# Altium schematic sheet Servo1.SchDoc
size 420 x 297 mm; SheetNumber: 9; SheetTotal: 32
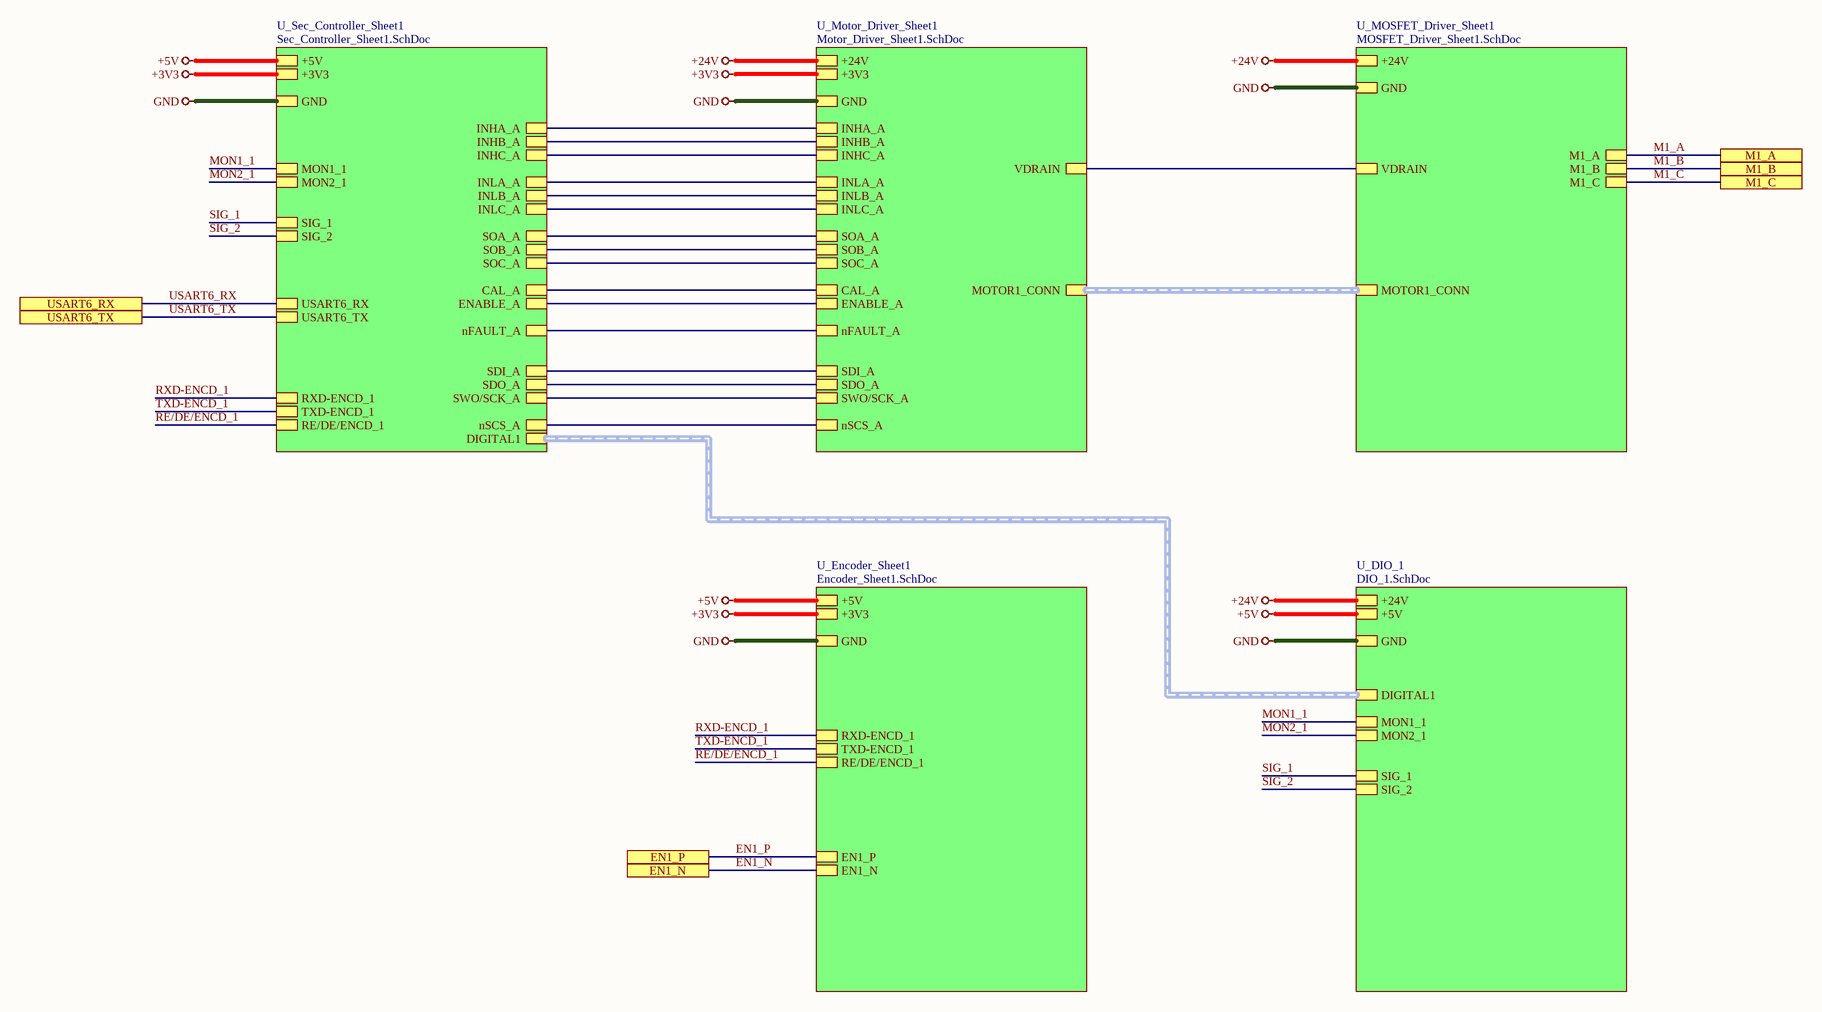
[diagram p0: Servo1.SchDoc]

## Sub-sheets
U_DIO_1 = DIO_1.SchDoc: +24V, +5V, GND, MON1_1, MON2_1, SIG_1, SIG_2, DIGITAL1 (harness DIGITAL1)
U_Encoder_Sheet1 = Encoder_Sheet1.SchDoc: +3V3, +5V, GND, RXD-ENCD_1, TXD-ENCD_1, RE/DE/ENCD_1, EN1_N, EN1_P
U_MOSFET_Driver_Sheet1 = MOSFET_Driver_Sheet1.SchDoc: +24V, GND, M1_A, M1_B, M1_C, MOTOR1_CONN (harness MOTOR1_CONN), VDRAIN
U_Motor_Driver_Sheet1 = Motor_Driver_Sheet1.SchDoc: +24V, +3V3, GND, MOTOR1_CONN (harness MOTOR1_CONN), INHA_A, INHB_A, INHC_A, INLA_A, INLB_A, INLC_A, nSCS_A, SDI_A, SDO_A, SWO/SCK_A, SOC_A, SOB_A, SOA_A, CAL_A, ENABLE_A, VDRAIN, nFAULT_A
U_Sec_Controller_Sheet1 = Sec_Controller_Sheet1.SchDoc: +3V3, GND, INHA_A, INHB_A, INHC_A, INLA_A, INLB_A, INLC_A, nSCS_A, SDI_A, SDO_A, SWO/SCK_A, SOC_A, SOB_A, SOA_A, CAL_A, ENABLE_A, nFAULT_A, USART6_RX, USART6_TX, RXD-ENCD_1, TXD-ENCD_1, RE/DE/ENCD_1, MON1_1, MON2_1, SIG_1, SIG_2, DIGITAL1 (harness DIGITAL1), +5V

## Ports
EN1_N (see Top_Sheet[4A], Connector_Sheet[3D], Encoder_Sheet1[2D]), EN1_P (see Top_Sheet[4A], Connector_Sheet[3D], Encoder_Sheet1[2D]), M1_A (see Top_Sheet[4B], Connector_Sheet[4D], MOSFET_Driver_Sheet1[4D]), M1_B (see Top_Sheet[4B], Connector_Sheet[4D], MOSFET_Driver_Sheet1[4D]), M1_C (see Top_Sheet[4B], Connector_Sheet[4D], MOSFET_Driver_Sheet1[4D]), USART6_RX (see Top_Sheet[4A], Controller_Sheet[2D], Sec_Controller_Sheet1[1D]), USART6_TX (see Top_Sheet[4A], Controller_Sheet[2D], Sec_Controller_Sheet1[1D])

## Nets
+3V3: sheet U_Sec_Controller_Sheet1/+3V3, sheet U_Motor_Driver_Sheet1/+3V3, sheet U_Encoder_Sheet1/+3V3
+5V: sheet U_Sec_Controller_Sheet1/+5V, sheet U_Encoder_Sheet1/+5V, sheet U_DIO_1/+5V
+24V: sheet U_Motor_Driver_Sheet1/+24V, sheet U_MOSFET_Driver_Sheet1/+24V, sheet U_DIO_1/+24V
GND: sheet U_Sec_Controller_Sheet1/GND, sheet U_Motor_Driver_Sheet1/GND, sheet U_MOSFET_Driver_Sheet1/GND, sheet U_Encoder_Sheet1/GND, sheet U_DIO_1/GND
EN1_N: port EN1_N, sheet U_Encoder_Sheet1/EN1_N
EN1_P: port EN1_P, sheet U_Encoder_Sheet1/EN1_P
M1_A: port M1_A, sheet U_MOSFET_Driver_Sheet1/M1_A
M1_B: port M1_B, sheet U_MOSFET_Driver_Sheet1/M1_B
M1_C: port M1_C, sheet U_MOSFET_Driver_Sheet1/M1_C
MON1_1: sheet U_Sec_Controller_Sheet1/MON1_1, sheet U_DIO_1/MON1_1
MON2_1: sheet U_Sec_Controller_Sheet1/MON2_1, sheet U_DIO_1/MON2_1
RE/DE/ENCD_1: sheet U_Sec_Controller_Sheet1/RE/DE/ENCD_1, sheet U_Encoder_Sheet1/RE/DE/ENCD_1
RXD-ENCD_1: sheet U_Sec_Controller_Sheet1/RXD-ENCD_1, sheet U_Encoder_Sheet1/RXD-ENCD_1
SIG_1: sheet U_Sec_Controller_Sheet1/SIG_1, sheet U_DIO_1/SIG_1
SIG_2: sheet U_Sec_Controller_Sheet1/SIG_2, sheet U_DIO_1/SIG_2
TXD-ENCD_1: sheet U_Sec_Controller_Sheet1/TXD-ENCD_1, sheet U_Encoder_Sheet1/TXD-ENCD_1
USART6_RX: port USART6_RX, sheet U_Sec_Controller_Sheet1/USART6_RX
USART6_TX: port USART6_TX, sheet U_Sec_Controller_Sheet1/USART6_TX
(unnamed): sheet U_Sec_Controller_Sheet1/INHA_A, sheet U_Motor_Driver_Sheet1/INHA_A
(unnamed): sheet U_Sec_Controller_Sheet1/INHB_A, sheet U_Motor_Driver_Sheet1/INHB_A
(unnamed): sheet U_Sec_Controller_Sheet1/INHC_A, sheet U_Motor_Driver_Sheet1/INHC_A
(unnamed): sheet U_Sec_Controller_Sheet1/INLA_A, sheet U_Motor_Driver_Sheet1/INLA_A
(unnamed): sheet U_Sec_Controller_Sheet1/INLB_A, sheet U_Motor_Driver_Sheet1/INLB_A
(unnamed): sheet U_Sec_Controller_Sheet1/INLC_A, sheet U_Motor_Driver_Sheet1/INLC_A
(unnamed): sheet U_Sec_Controller_Sheet1/nSCS_A, sheet U_Motor_Driver_Sheet1/nSCS_A
(unnamed): sheet U_Sec_Controller_Sheet1/SDI_A, sheet U_Motor_Driver_Sheet1/SDI_A
(unnamed): sheet U_Sec_Controller_Sheet1/SDO_A, sheet U_Motor_Driver_Sheet1/SDO_A
(unnamed): sheet U_Sec_Controller_Sheet1/SWO/SCK_A, sheet U_Motor_Driver_Sheet1/SWO/SCK_A
(unnamed): sheet U_Sec_Controller_Sheet1/SOC_A, sheet U_Motor_Driver_Sheet1/SOC_A
(unnamed): sheet U_Sec_Controller_Sheet1/SOB_A, sheet U_Motor_Driver_Sheet1/SOB_A
(unnamed): sheet U_Sec_Controller_Sheet1/SOA_A, sheet U_Motor_Driver_Sheet1/SOA_A
(unnamed): sheet U_Sec_Controller_Sheet1/CAL_A, sheet U_Motor_Driver_Sheet1/CAL_A
(unnamed): sheet U_Sec_Controller_Sheet1/ENABLE_A, sheet U_Motor_Driver_Sheet1/ENABLE_A
(unnamed): sheet U_Sec_Controller_Sheet1/nFAULT_A, sheet U_Motor_Driver_Sheet1/nFAULT_A
(unnamed): sheet U_Motor_Driver_Sheet1/VDRAIN, sheet U_MOSFET_Driver_Sheet1/VDRAIN

## Buses and harness runs
harness sheet U_DIO_1/DIGITAL1 = sheet U_Sec_Controller_Sheet1/DIGITAL1
harness sheet U_MOSFET_Driver_Sheet1/MOTOR1_CONN = sheet U_Motor_Driver_Sheet1/MOTOR1_CONN

## Notes on the sheet
- File:
- Title:
- Date:
- Page
- Num:
- Total:
- Drawn By: Huzaifa Ali